# EAGLE design Olimex ESP32 Breakout v1 (EAGLE 9.6.2)
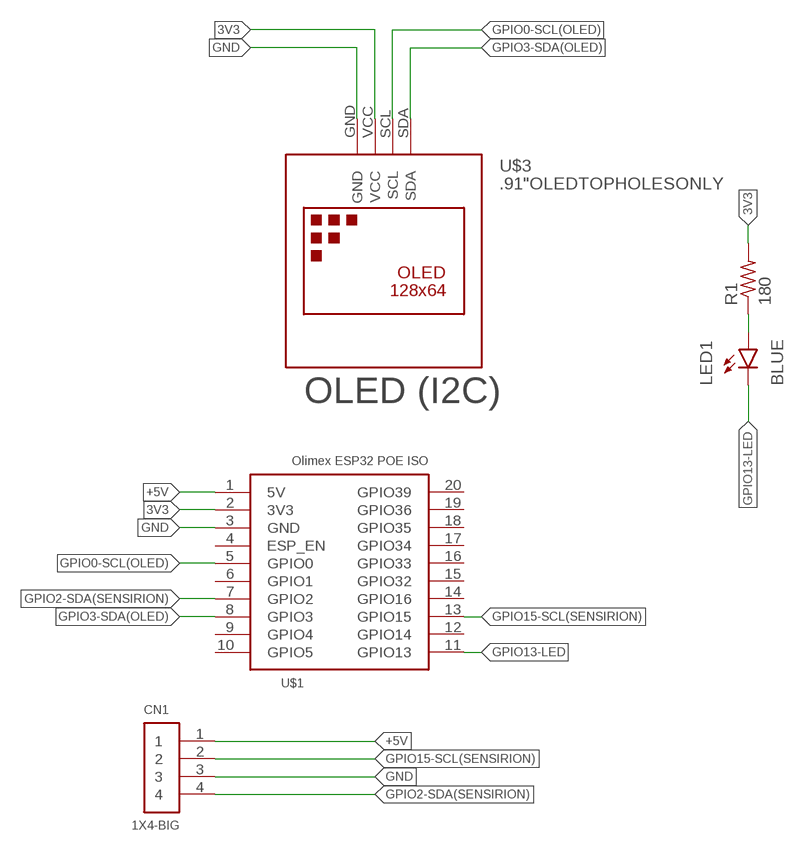
[diagram p0: schematic, sheet 1]

## Parts
CN1  1X4-BIG  [1X04-BIG]
LED1  BLUE  LED-BLUE1206  [LED-1206]
R1  180  R-US_R0805  [R0805]
U$1  OLIMEX_POE_ISOPOEISO  [OLIMEX_POE_ISO]
U$3  .91"OLEDTOPHOLESONLY  [.96"OLED-TOPHOLESONLY]

## Nets
3V3 [Power]: R1.2 U$1.2(3V3) U$3.VCC
+5V: CN1.1 U$1.1(5V)
BLUEX: LED1.A R1.1
GND [Power]: CN1.3 U$1.3(GND) U$3.GND
GPIO0-SCL(OLED): U$1.5(GPIO0) U$3.SCL
GPIO2-SDA(SENSIRION): CN1.4 U$1.7(GPIO2)
GPIO3-SDA(OLED): U$1.8(GPIO3) U$3.SDA
GPIO13-LED: LED1.C U$1.11(GPIO13)
GPIO15-SCL(SENSIRION): CN1.2 U$1.13(GPIO15)
Unconnected: U$1.4(ESP_EN) U$1.6(GPIO1) U$1.9(GPIO4) U$1.10(GPIO5) U$1.12(GPIO14) U$1.14(GPIO16) U$1.15(GPIO32) U$1.16(GPIO33) U$1.17(GPIO34) U$1.18(GPIO35) U$1.19(GPIO36) U$1.20(GPIO39)

## Notes on the sheet
- OLED (I2C)

## Library data of the parts
CN1 = adafruit:1X4: 4-pin connector
LED1 = SparkFun-LED:LED-BLUE: Blue SMD LED Used in manufacturing of various products at SparkFun Packages: 0603 - SMD 0603 package [Product Link] <http://www.digikey.com/product-detail/en/SMLE12BC7TT86/511-1589-2-ND/1641808> 1206 - SMD1206 package [Product Link] <http://www.digikey.com/product-detail/en/lite-on-inc/LTST-C150TBKT/160-1643-1-ND/573584> SparkFun Products: ESP8266 Thing-Dev Board <https://www.sparkfun.com/products/13711> RedBoard <https://www.sparkfun.com/products/12757>; PROD_ID: DIO-09911
R1 = rcl:R-US_: RESISTOR, American symbol; SPICEPREFIX: R
U$1 = ESP32-DEVKITC:OLIMEX_POE_ISO
U$3 = oled:.91"OLED

## Net classes
0 default: width 0.203 mm, drill 0.203 mm, clearance 0.152 mm
1 Power: width 0.203 mm, drill 0.203 mm, clearance 0.152 mm
2 bigpower: clearance 0.152 mm
3 DSP: width 0.203 mm, clearance 0.152 mm

## Board
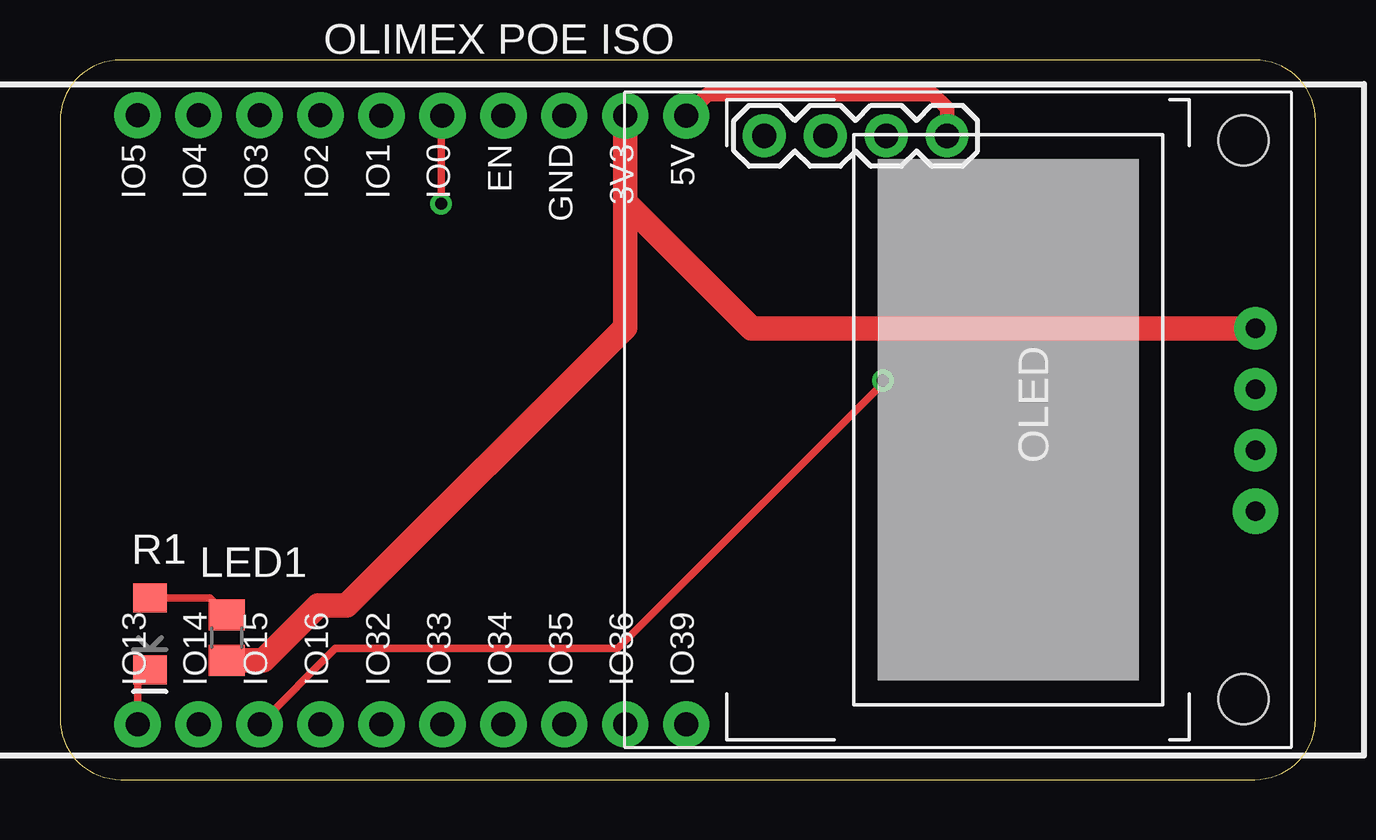
[diagram p1: board, top side]
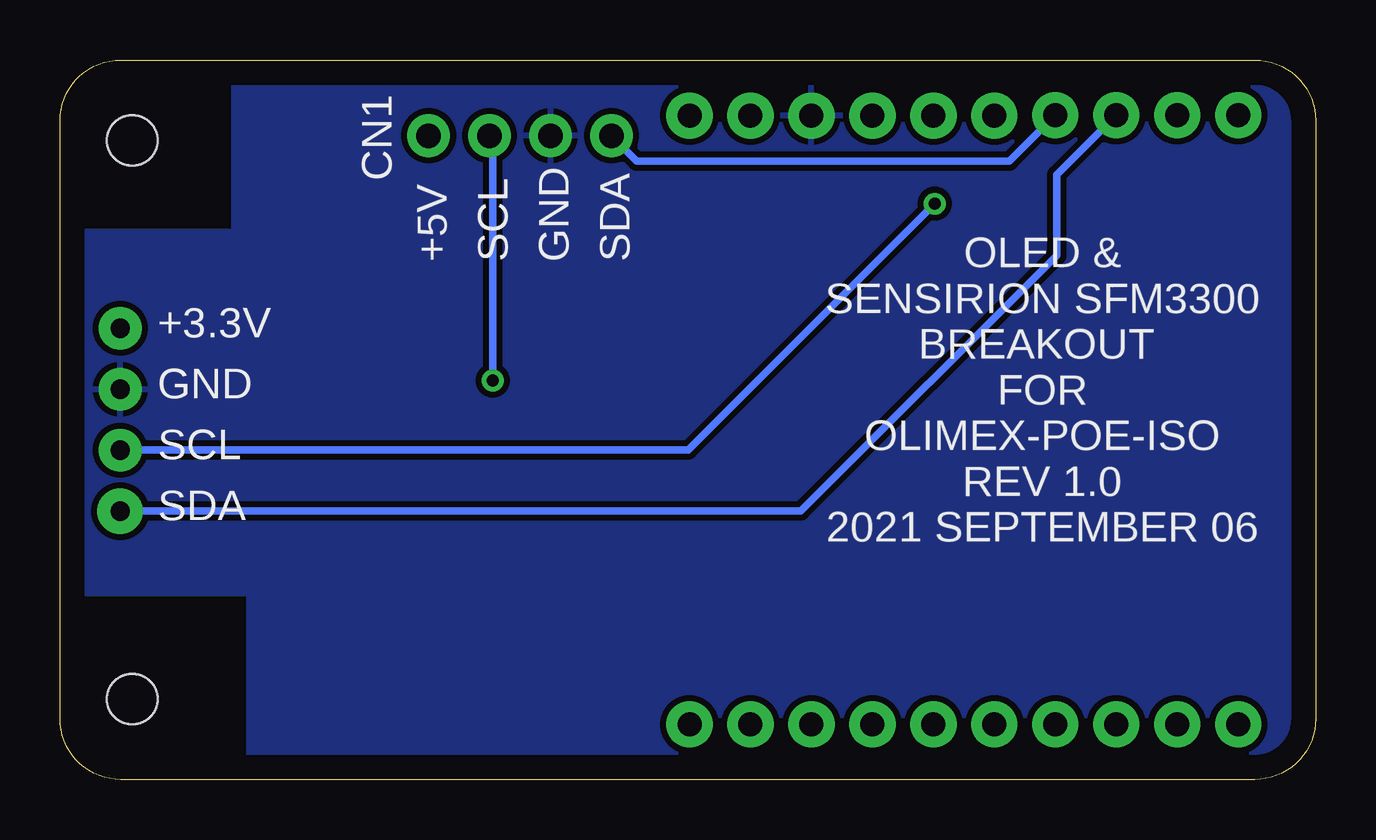
[diagram p2: board, bottom side, seen from below]

Size 52.32 x 30 mm. Coordinates in mm from the lower left corner, seen from the top.
Outline: 2.54,0 49.78,0 arc90 52.32,2.54 52.32,27.46 arc90 49.78,30 2.54,30 arc90 0,27.46 0,2.54 arc90 2.54,0
Copper layers (1*16): Top 0.035mm / dielectric 1.5mm / Bottom 0.035mm
Design rules "default": minimum track width 6mil, minimum drill 0.35mm, track to track 6mil, track to pad 6mil, pad to pad 6mil, via to via 6mil, smd to smd 6mil, copper to edge 40mil, drill to drill 6mil, minimum pad ring 10mil, minimum via ring 8mil, stop-mask expansion 4mil, vias tented up to drill 0mil, thermal gap 10mil

### Footprints (pad centres in the part's own frame; a part is rotated, then mirrored left to right if it is on the bottom)
1X04-BIG = drill 1.016 pad 1.778: 1 0,0; 2 2.54,0; 3 5.08,0; 4 7.62,0
LED-1206 = smd 1.2 x 1.4: A -1.5,0; C 1.5,0
R0805 = smd 1.3 x 1.5: 1 -0.95,0; 2 0.95,0
OLIMEX_POE_ISO = drill 1 pad 1.93: 1 -18.27,-12.68; 2 -15.729,-12.68; 3 -13.19,-12.68; 4 -10.649,-12.68; 5 -8.11,-12.68; 6 -5.569,-12.68; 7 -3.03,-12.7; 8 -0.489,-12.7; 9 2.05,-12.7; 10 4.59,-12.7; 11 4.59,12.7; 12 2.05,12.7; 13 -0.489,12.7; 14 -3.03,12.7; 15 -5.569,12.7; 16 -8.11,12.7; 17 -10.649,12.7; 18 -13.19,12.7; 19 -15.729,12.7; 20 -18.27,12.7
.96"OLED-TOPHOLESONLY = drill 0.8 pad 1.778: GND -1.27,-1.5; SCL 1.27,-1.5; VCC -3.81,-1.5 | drill 0.8 pad 1.9: SDA 3.81,-1.5 | hole 2.1: -11.65,-2; 11.65,-2

### Placement (x,y rotation side)
CN1  36.97,26.84 180 top
LED1  3.74,6.07 270 top
R1  6.95,5.92 270 top
U$1  7.82,15 180 top
U$3  51.32,15 270 top

### Tracks (layer width: path | path; a pad name or v marks a point on that pad's centre or on a via)
3V3
  Top 1.016: U$1.2 23.55,24.07 | U$3.VCC 28.82,18.81 23.55,24.07 | 23.55,24.07 23.55,18.85 11.95,7.25 10.76,7.25 8.47,4.96 R1.2
+5V
  Top 0.61: CN1.1 36.97,27.98 36.37,28.57 26.99,28.57 U$1.1
BLUEX
  Top 0.305: LED1.A 6.25,7.57 R1.1
GND
  pour Bottom (isolate 0.254): -2.54,32.54 -2.54,-2.54 44.45,-2.54 44.45,7.75 54.13,7.75 54.13,22.86 45.09,22.86 45.09,32.54
GPIO0-SCL(OLED)  (via drill 0.5)
  Top 0.305: v15.88,24 15.88,27.62 U$1.5
  Bottom 0.305: U$3.SCL 26.15,13.73 v15.88,24
GPIO2-SDA(SENSIRION)
  Bottom 0.305: U$1.7 12.77,25.78 28.29,25.78 CN1.4
GPIO3-SDA(OLED)
  Bottom 0.305: U$1.8 10.79,25.22 10.79,21.84 21.45,11.19 U$3.SDA
GPIO13-LED
  Top 0.305: U$1.11 3.23,4.06 LED1.C
GPIO15-SCL(SENSIRION)  (via drill 0.5)
  Top 0.305: U$1.13 11.47,5.46 23.24,5.46 34.29,16.51 v34.29,16.64
  Bottom 0.305: v34.29,16.64 34.29,26.71 CN1.2

### Text on the board
tNames: OLED
bNames: SDA | GND | SCL | +5V | +3.3V | OLED & / SENSIRION SFM3300 / BREAKOUT / FOR / OLIMEX-POE-ISO / REV 1.0 / 2021 SEPTEMBER 06 | GND | SCL | SDA